# Altium schematic sheet 3-PowerPeripherals.schdoc
size 600 x 386 mm
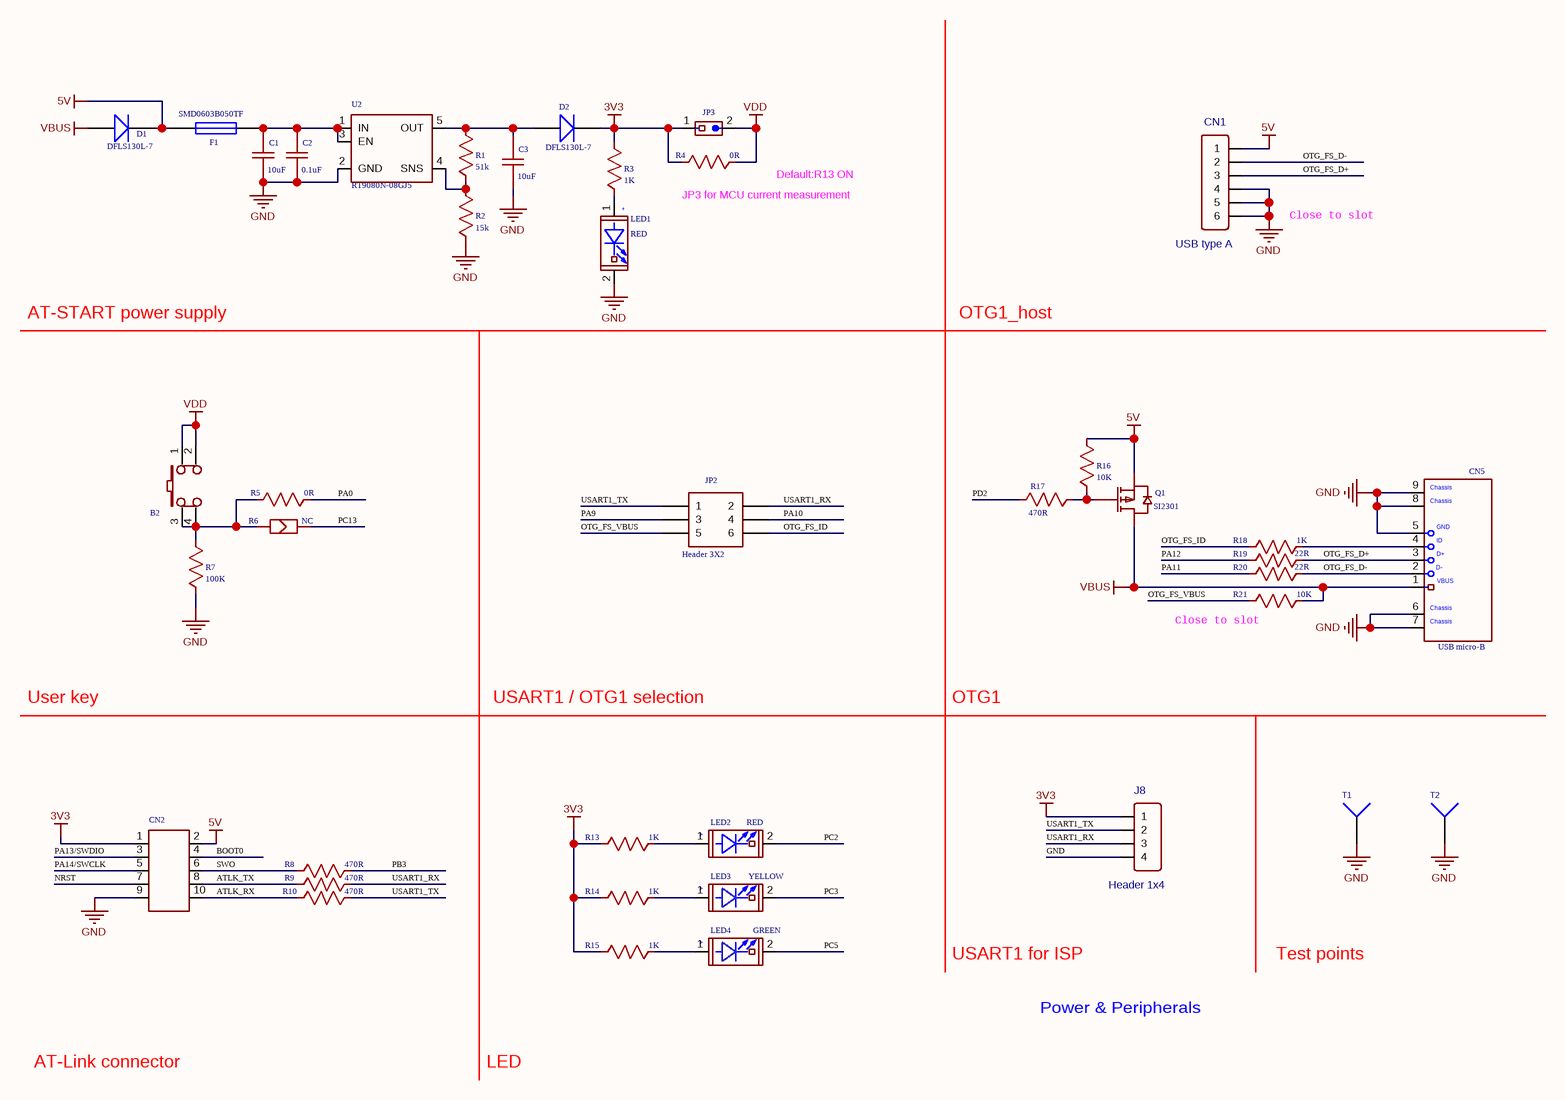
[diagram p0: 3-PowerPeripherals.schdoc]

## Parts
B2  BUTTON_SMT,6.0x6.0x4.5mm  [BUTTON_SMT_6*6*5]  (value not drawn)
C1  10uF  [0603_C-M]
C2  0.1uF  [0603_C-M]
C3  10uF  [0603_C-M]
CN1  USB type A  [USB-A-TH__USB-AF-90]
CN2  NC(Header 2x5)  [HDR2X5]  (value not drawn)
CN5  USB micro-B  [USB_MIC_DIP]
D1  DFLS130L-7  [SOD-123]
D2  DFLS130L-7  [SOD-123]
F1  SMD0603B050TF  [R0603]
J8  Header 1x4  [HDR1X4]
JP2  Header 3X2  [HDR2X3]
JP3  NC(Header 1x2)  [HEADER 1X2]  (value not drawn)
LED1  RED  [LED0603]
LED2  RED  [LED0603]
LED3  YELLOW  [LED0603]
LED4  GREEN  [LED0603]
Q1  SI2301  [SOT-23-3_L2.9-W1.3-P1.90-LS2.4-BR]
R1  51k  [0603_R-M]
R2  15k  [0603_R-M]
R3  1K  [0603_R-M]
R4  0R  [0603_R-M]
R5  0R  [0603_R-M]
R6  NC  [SB-PAD]
R7  100K  [0603_R-M]
R8  470R  [0603_R-M]
R9  470R  [0603_R-M]
R10  470R  [0603_R-M]
R13  1K  [0603_R-M]
R14  1K  [0603_R-M]
R15  1K  [0603_R-M]
R16  10K  [0603_R-M]
R17  470R  [0603_R-M]
R18  1K  [0603_R-M]
R19  22R  [0603_R-M]
R20  22R  [0603_R-M]
R21  10K  [0603_R-M]
T1  Testpoint  [TESTHOOK]  (value not drawn)
T2  Testpoint  [TESTHOOK]  (value not drawn)
U2  RT9080N-08GJ5  [SOT-23-5]

## Nets
3V3: CN2.1 D2.2(K) J8.1 JP3.1 R3.1 R4.2 R13.2 R14.2 R15.2
5V: CN1.1 CN2.2 D1.2(K) F1.1 Q1.2(S) R16.1
GND: C1.2 C2.2 C3.2 CN1.4 CN1.SH1(5) CN1.SH2(6) CN2.9 CN5.5(GND) CN5.6 CN5.7 CN5.8 CN5.9 J8.4 LED1.2(CATHODE) R2.1 R7.2 T1.1 T2.1 U2.2(GND)
VBUS: CN5.1(VBUS) D1.1(A) Q1.3(D) R21.1
VDD: B2.1 B2.2 JP3.2 R4.1
ATLK_RX: CN2.10 R10.2
ATLK_TX: CN2.8 R9.2
BOOT0: CN2.4
NRST: CN2.7
OTG_FS_D+: CN1.3 CN5.3(D+) R19.2
OTG_FS_D-: CN1.2 CN5.2(D-) R20.1
OTG_FS_ID: JP2.6 R18.2
OTG_FS_VBUS: JP2.5 R21.2
PA0: R5.1
PA9: JP2.3
PA10: JP2.4
PA11: R20.2
PA12: R19.1
PA13/SWDIO: CN2.3
PA14/SWCLK: CN2.5
PB3: R8.1
PC2: LED2.2(CATHODE)
PC3: LED3.2(CATHODE)
PC5: LED4.2(CATHODE)
PC13: R6.2
PD2: R17.2
SWO: CN2.6 R8.2
USART1_RX: J8.3 JP2.2 R9.1
USART1_TX: J8.2 JP2.1 R10.1
NetB2_3: B2.3 B2.4 R5.2 R6.1 R7.1
NetC1_1: C1.1 C2.1 F1.2 U2.1(IN) U2.3(EN)
NetC3_1: C3.1 D2.1(A) R1.2 U2.5(OUT)
NetCN5_4: CN5.4(ID) R18.1
NetLED1_1: LED1.1(ANODE) R3.2
NetLED2_1: LED2.1(ANODE) R13.1
NetLED3_1: LED3.1(ANODE) R14.1
NetLED4_1: LED4.1(ANODE) R15.1
NetQ1_1: Q1.1(G) R16.2 R17.1
NetR1_1: R1.1 R2.2 U2.4(SNS)

## Notes on the sheet
- (near R4) JP3 for MCU current measurement
- Default:R13 ON
- Close to slot
- AT-START power supply
- OTG1_host
- (near R21) Close to slot
- User key
- USART1 / OTG1 selection
- OTG1
- USART1 for ISP
- Test points
- Power & Peripherals
- AT-Link connector
- LED
- (in symbol GREEN) +
- (in symbol RED) +
- (in symbol USB micro-B) Chassis
- (in symbol YELLOW) +

## Library data of the parts
B2 = BUTTON_SMT,6.0x6.0x4.5mm: Contributor: twb17; spicePre: S; spiceSymbolName: Button,SMD_4P
C1 C3 = 10uF: nameAlias: Value(F); Contributor: LCEDA_Lib; spicePre: C; spiceSymbolName: C_0603_US
C2 = 0.1uF: nameAlias: Value(F); Contributor: LCEDA_Lib; spicePre: C; spiceSymbolName: C_0603_US
CN1 = USB type A: Contributor: LCEDA_Lib; BOM_Supplier Part: C40877; BOM_Supplier: LCSC; spicePre: H; spiceSymbolName: HDR-F-2.54_1x6
J8 = Header 1x4: Contributor: LCEDA_Lib; BOM_Supplier Part: C124378; BOM_Supplier: LCSC; spicePre: J; spiceSymbolName: HDR-M-2.54_1x4
JP2 = Header 3X2: Contributor: twb17; LatestRevisionDate: 17-Jul-2002; LatestRevisionNote: Re-released for DXP Platform.; Publisher: Altium Limited; spicePre: J; spiceSymbolName: Header 3X2
Q1 = SI2301: BOM_Manufacturer: FM; BOM_Manufacturer Part: 2301; BOM_Paste Type: recommend; BOM_Supplier: LCSC; BOM_Supplier Part: C86773; spicePre: Q; spiceSymbolName: 2301
R1 = 51k: nameAlias: Value(Ω); Contributor: LCEDA_Lib; spicePre: R; spiceSymbolName: R_0603_US
R2 = 15k: nameAlias: Value(Ω); Contributor: LCEDA_Lib; spicePre: R; spiceSymbolName: R_0603_US
R3 R13-R15 R18 = 1K: nameAlias: Value(Ω); Contributor: LCEDA_Lib; spicePre: R; spiceSymbolName: R_0603_US
R4 R5 = 0R: nameAlias: Value(Ω); Contributor: LCEDA_Lib; spicePre: R; spiceSymbolName: R_0603_US
R6 = NC: Contributor: twb17; spicePre: R; spiceSymbolName: Solder bridge
R7 = 100K: nameAlias: Value(Ω); Contributor: LCEDA_Lib; spicePre: R; spiceSymbolName: R_0603_US
R8-R10 R17 = 470R: nameAlias: Value(Ω); Contributor: LCEDA_Lib; spicePre: R; spiceSymbolName: R_0603_US
R16 R21 = 10K: nameAlias: Value(Ω); Contributor: LCEDA_Lib; spicePre: R; spiceSymbolName: R_0603_US
R19 R20 = 22R: nameAlias: Value(Ω); Contributor: LCEDA_Lib; spicePre: R; spiceSymbolName: R_0603_US
D1 D2 = DFLS130L-7: Published: 8-Jun-2000; LatestRevisionDate: 17-Jul-2002; LatestRevisionNote: Re-released for DXP Platform.; PackageVersion: Sep-1996; PackageReference: SMC; Publisher: Altium Limited; PackageDescription: DO-214-AB/SMC; 2 C-Bend Leads; Body 7.9 x 5.9 mm, inc. leads (LxW); Code_JEDEC: DO-214-AB
F1 = SMD0603B050TF: Published: 8-Jun-2000; LatestRevisionDate: 17-Jul-2002; LatestRevisionNote: Re-released for DXP Platform.; PackageReference: PIN-W2/E2.8; Publisher: Altium Limited; PackageDescription: Thru-Hole; 2 Leads
T1 T2 = Testpoint: LatestRevisionDate: 17-Jul-2002; LatestRevisionNote: Re-released for DXP Platform.; Publisher: Altium Limited